# Altium schematic sheet CMOD_A7.SchDoc: CMOD-A7
size 420 x 297 mm; Author: P. Zdunek; CompanyName: WUT ISE; DrawnBy: P. Zdunek; Organization: WUT ISE; Address1: PW ISE; Address2: Nowowiejska 15/19 00-665 Warsaw; Address3: p.zdunek90@gmail.com; DocumentNumber: 3; Revision: 2; SheetNumber: 3; SheetTotal: 10; ModifiedBy: -; CheckedDate: -; DivGrp: WUT ISE; Designer: P. Zdunek; ModifiedDate: -; ProjectName: Sensor Box
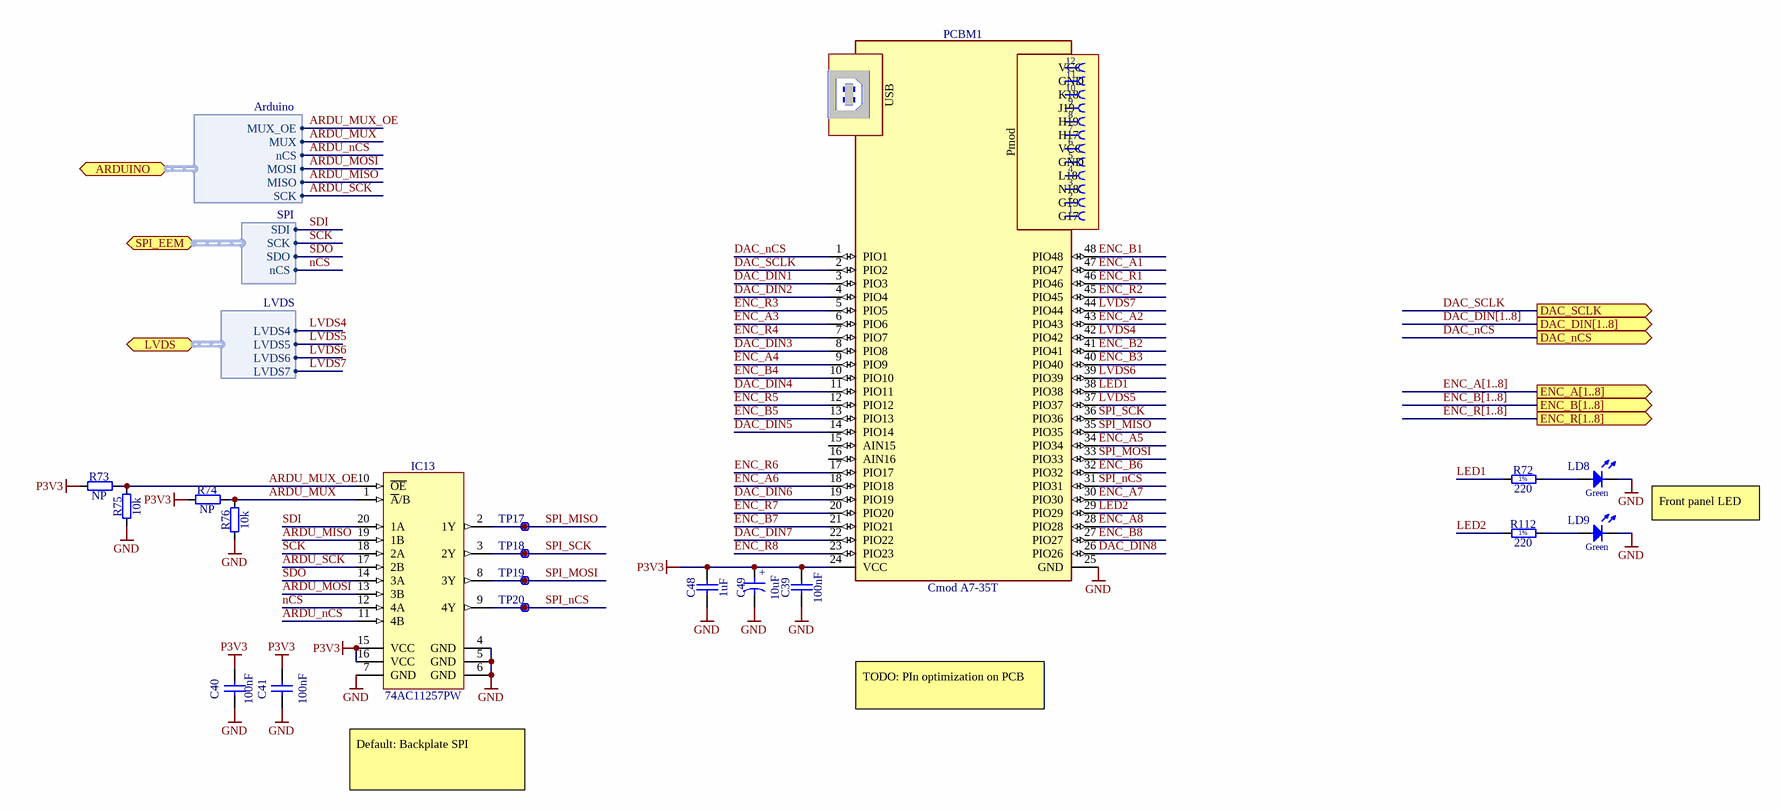
[diagram p0: CMOD_A7.SchDoc]

## Parts
C39  100nF  [CAPC1005X55N]
C40  100nF  [CAPC1005X55N]
C41  100nF  [CAPC1005X55N]
C48  1uF  [CAPC1608X87N]
C49  10uF  [CAPMP3216X180N]
IC13  74AC11257PW  [SOP65P640X120-20N]
LD8  Green  [LED_DIALIGHT_555-230]
LD9  Green  [LED_DIALIGHT_555-230]
PCBM1  Cmod A7-35T  [PCBM_DIGILENT_CMODA7]
R72  220  [RESC1608X55N]
R73  NP  [RESC1005X40N]
R74  NP  [RESC1005X40N]
R75  10k  [RESC1005X40N]
R76  10k  [RESC1005X40N]
R112  220  [RESC1608X55N]
TP17  Plated Hole  [c130h60]  (value not drawn)  (no BOM)
TP18  Plated Hole  [c130h60]  (value not drawn)  (no BOM)
TP19  Plated Hole  [c130h60]  (value not drawn)  (no BOM)
TP20  Plated Hole  [c130h60]  (value not drawn)  (no BOM)

## Ports
ARDUINO (bidir, harness Arduino), DAC_DIN[1..8] (out), DAC_nCS (out), DAC_SCLK (out), ENC_A[1..8] (out), ENC_B[1..8] (out), ENC_R[1..8] (out), LVDS (bidir, harness LVDS), SPI_EEM (bidir, harness SPI)

## Harnesses
Arduino: nCS, MOSI, MISO, SCK, MUX_OE, MUX
SPI: SDI, SCK, SDO, nCS
LVDS: LVDS4, LVDS5, LVDS6, LVDS7

## Nets
GND: C39.1 C40.1 C41.1 C48.1 C49.2 IC13.4(GND) IC13.5(GND) IC13.6(GND) IC13.7(GND) LD8.1(C) LD9.1(C) PCBM1.25(GND) R75.1 R76.1
P3V3: C39.2 C40.2 C41.2 C48.2 C49.1 IC13.15(VCC) IC13.16(VCC) PCBM1.24(VCC) R73.1 R74.1
ARDU_MISO: IC13.19(1B) ; port ARDUINO.MISO
ARDU_MOSI: IC13.13(3B) ; port ARDUINO.MOSI
ARDU_MUX: IC13.1(~{A}/B) R74.2 R76.2 ; port ARDUINO.MUX
ARDU_MUX_OE: IC13.10(~{OE}) R73.2 R75.2 ; port ARDUINO.MUX_OE
ARDU_nCS: IC13.11(4B) ; port ARDUINO.nCS
ARDU_SCK: IC13.17(2B) ; port ARDUINO.SCK
DAC_DIN1: PCBM1.3(PIO3)
DAC_DIN2: PCBM1.4(PIO4)
DAC_DIN3: PCBM1.8(PIO8)
DAC_DIN4: PCBM1.11(PIO11)
DAC_DIN5: PCBM1.14(PIO14)
DAC_DIN6: PCBM1.19(PIO19)
DAC_DIN7: PCBM1.22(PIO22)
DAC_DIN8: PCBM1.26(PIO26)
DAC_nCS: PCBM1.1(PIO1) ; port DAC_nCS
DAC_SCLK: PCBM1.2(PIO2) ; port DAC_SCLK
ENC_A1: PCBM1.47(PIO47)
ENC_A2: PCBM1.43(PIO43)
ENC_A3: PCBM1.6(PIO6)
ENC_A4: PCBM1.9(PIO9)
ENC_A5: PCBM1.34(PIO34)
ENC_A6: PCBM1.18(PIO18)
ENC_A7: PCBM1.30(PIO30)
ENC_A8: PCBM1.28(PIO28)
ENC_B1: PCBM1.48(PIO48)
ENC_B2: PCBM1.41(PIO41)
ENC_B3: PCBM1.40(PIO40)
ENC_B4: PCBM1.10(PIO10)
ENC_B5: PCBM1.13(PIO13)
ENC_B6: PCBM1.32(PIO32)
ENC_B7: PCBM1.21(PIO21)
ENC_B8: PCBM1.27(PIO27)
ENC_R1: PCBM1.46(PIO46)
ENC_R2: PCBM1.45(PIO45)
ENC_R3: PCBM1.5(PIO5)
ENC_R4: PCBM1.7(PIO7)
ENC_R5: PCBM1.12(PIO12)
ENC_R6: PCBM1.17(PIO17)
ENC_R7: PCBM1.20(PIO20)
ENC_R8: PCBM1.23(PIO23)
LED1: PCBM1.38(PIO38) R72.1
LED2: PCBM1.29(PIO29) R112.1
LVDS4: PCBM1.42(PIO42) ; port LVDS.LVDS4
LVDS5: PCBM1.37(PIO37) ; port LVDS.LVDS5
LVDS6: PCBM1.39(PIO39) ; port LVDS.LVDS6
LVDS7: PCBM1.44(PIO44) ; port LVDS.LVDS7
nCS: IC13.12(4A) ; port SPI_EEM.nCS
SCK: IC13.18(2A) ; port SPI_EEM.SCK
SDI: IC13.20(1A) ; port SPI_EEM.SDI
SDO: IC13.14(3A) ; port SPI_EEM.SDO
SPI_MISO: IC13.2(1Y) PCBM1.35(PIO35) TP17.1
SPI_MOSI: IC13.8(3Y) PCBM1.33(PIO33) TP19.1
SPI_nCS: IC13.9(4Y) PCBM1.31(PIO31) TP20.1
SPI_SCK: IC13.3(2Y) PCBM1.36(PIO36) TP18.1
NetLD8_2: LD8.2(A) R72.2
NetLD9_2: LD9.2(A) R112.2

Not connected (* = marked no-connect by the designer): PCBM1 15(AIN15) 16(AIN16)

## Buses and harness runs
bus DAC_DIN[1..8] = port DAC_DIN[1..8]
bus ENC_A[1..8] = port ENC_A[1..8]
bus ENC_B[1..8] = port ENC_B[1..8]
bus ENC_R[1..8] = port ENC_R[1..8]

## Notes on the sheet
- Front panel LED
- TODO: PIn optimization on PCB
- Default: Backplate SPI
- Project/Equipment
- Document
- Designer
- Drawn by
- Check.by
- Copyright WUT ISE 2020.
  This documentation describes Open Hardware and is licensed under the CERN OHL v.1.2. You may redistribute and modify this documentation under the terms of the CERN OHL v.1.2. (http://ohwr.org/CERNOHL). This documentation is distributed WITHOUT ANY EXPRESS OR IMPLIED WARRANTY, INCLUDING OF MERCHANTABILITY, SATISFACTORY QUALITY AND FITNESS FOR A PARTICULAR PURPOSE. Please see the CERN OHL v.1.2 for applicable conditions.
- Contact
- File
- Last Mod.
- Print Date
- Sheet
- Size
- A3
- of
- Rev
- (in symbol CTE3216-18_10UF_16V_20%_AVX_TCJ) +
- (in symbol PCBM_DIGILENT_CMOD A7-35T) USB; K18; J19; H19; H17; Pmod; L18; N18; G19; G17
- (in symbol R0603_220R_1%_0.1W_100PPM) 1%

## Library data of the parts
C39-C41 = CC0402_100NF_16V_10%_X5R: Non-polarised capacitor; Part Description: SMD Multilayer Chip Ceramic Capacitor; Manufacturer: GENERIC; Manufacturer1 Part Number: GRM155R61C104KA88D; Voltage: 16V; TC: X5R; Tolerance: ±10%; Part Number: CC0402_100NF_16V_10%_X5R; Component Kind: Standard; Component Type: Standard; Pin Count: 2; Value: 100nF; Status: None; Manufacturer Part Number: CC0402_100NF_16V_10%_X5R; Case: 0402; Mounted: Yes; Socket: No; SMD: Yes; Sense: No; Manufacturer1 Example: MURATA; Manufacturer1 ComponentHeight: 0.55mm; HelpURL: \\cern.ch\dfs\Applications\Altium\Datasheets\CC0402_X5R_MURATA_GRM.pdf; Author: CERN DEM JLC
  C39: CreateDate: 10.12.2013; LatestRevisionDate: 10.12.2013
  C40 C41: CreateDate: 10/12/2013; LatestRevisionDate: 10/12/2013
C48 = CC0603_1UF_25V_10%_X7R: Non-polarised capacitor; Part Description: SMD Multilayer Chip Ceramic Capacitor; Manufacturer: GENERIC; Manufacturer1 Part Number: GRM188R71E105KA12D; Voltage: 25V; TC: X7R; Tolerance: ±10%; Part Number: CC0603_1UF_25V_10%_X7R; Component Kind: Standard; Component Type: Standard; Pin Count: 2; Value: 1uF; Status: None; Manufacturer Part Number: CC0603_1UF_25V_10%_X7R; Case: 0603; Mounted: Yes; Socket: No; SMD: Yes; Sense: No; Manufacturer1 Example: MURATA; Manufacturer1 ComponentHeight: 0.9mm; HelpURL: \\cern.ch\dfs\Applications\Altium\Datasheets\CC0603_X7R_MURATA.pdf; Author: CERN DEM JLC; CreateDate: 18.01.2011; LatestRevisionDate: 18.01.2011
C49 = CTE3216-18_10UF_16V_20%_AVX_TCJ: Polarised capacitor; Part Description: ESR 0R200 Tantalum Solid Electrolytic Chip Capacitor with Conductive Polymer Electrode; Manufacturer: AVX; Manufacturer Part Number: TCJA106M016R0200 or  or TR3A106K016C1700; Voltage: 16V; Tolerance: ±20%; Part Number: CTE3216-18_10UF_16V_20%_AVX_TCJ; Component Kind: Standard; Component Type: Standard; Pin Count: 2; Value: 10uF; Status: Preferred; Case: A; Mounted: Yes; Socket: No; SMD: Yes; Sense: No; ComponentHeight: 1.8mm; HelpURL: \\cern.ch\dfs\Applications\Altium\Datasheets\CTE_AVX_TCJ.pdf; Author: CERN DEM JLC; CreateDate: 29.03.2012; LatestRevisionDate: 29.03.2012
IC13 = 74AC11257PW: Quadruple 2-Line to 1-Line Data Selector/Multiplexer With 3-State Outputs; Manufacturer: TEXAS INSTRUMENTS; PressFit: No; Bonding: No; Part Number: 74AC11257PW; Component Kind: Standard; Component Type: Standard; Device: 74AC11257PW; PackageDescription: SOP, 20-Leads, Body 6.5x4.4mm, Pitch 0.65mm, IPC Medium Density; Part Description: Quadruple 2-Line to 1-Line Data Selector/Multiplexer with 3-State Outputs; Manufacturer Part Number: 74AC11257PW; Pin Count: 20; Case: TSSOP20; Mounted: Yes; Socket: No; SMD: Yes; Sense: No; ComponentHeight: 1.2mm; Author: CERN DEM JLC; HelpURL: \\cern.ch\dfs\Applications\Altium\Datasheets\74AC11257PW.pdf; CreateDate: 26/03/2012; LatestRevisionDate: 26/03/2012
LD8 LD9 = LED_DIALIGHT_555-2301F: LED Green 1C 2A; Part Description: Single 2mm Green LED CBI® Circuit Board Indicator; PressFit: No; Bonding: No; Part Number: LED_DIALIGHT_555-2301F; Component Kind: Standard; Component Type: Standard; Color: Green; PackageDescription: Single 2mm Green LED, Body 5.08x2.54mm, Pin spacing 2.54mm; Manufacturer: DIALIGHT; Manufacturer Part Number: 555-2301F; Pin Count: 2; Mounted: Yes; Socket: No; SMD: No; Sense: No; ComponentHeight: 6.35mm; HelpURL: \\cern.ch\dfs\Applications\Altium\Datasheets\LED_DIALIGHT_555-2301F.pdf; Author: CERN DEM JMW; CreateDate: 22.09.2008; LatestRevisionDate: 17.03.2010
PCBM1 = PCBM_DIGILENT_CMOD A7-35T: Breadboardable Artix-7 FPGA Module; PressFit: No; Bonding: No; Part Number: PCBM_DIGILENT_CMOD A7-35T; Component Kind: Standard; Component Type: Standard; Device: Cmod A7-35T; PackageDescription: Breadboardable Artix-7 FPGA Module; Part Description: Breadboardable Artix-7 FPGA Module; Manufacturer: DIGILENT; Manufacturer Part Number: Cmod A7-35T; Pin Count: 48; Mounted: Yes; Socket: No; SMD: No; Sense: No; ComponentHeight: 12.55mm; Author: CERN DEM BC; HelpURL: \\cern.ch\dfs\Applications\Altium\Datasheets\PCBM_DIGILENT_CMODA7.pdf; CreateDate: 07/02/2019; LatestRevisionDate: 06/02/2023
R72 R112 = R0603_220R_1%_0.1W_100PPM: Resistor - 1%; Part Description: General Purpose Thick Film Chip Resistor; Manufacturer: GENERIC; Manufacturer1 Part Number: NRC06F2200TRF; Power: 0.1W; TC: ±100ppm/°C; Part Number: R0603_220R_1%_0.1W_100PPM; Component Kind: Standard; Component Type: Standard; Pin Count: 2; Value: 220; Status: Preferred; Tolerance: ±1%; Manufacturer Part Number: R0603_220R_1%_0.1W_100PPM; Case: 0603; Mounted: Yes; Sense: No; Socket: No; SMD: Yes; Manufacturer1 Example: NIC COMPONENT; Manufacturer1 ComponentHeight: 0.55mm; HelpURL: \\cern.ch\dfs\Applications\Altium\Datasheets\R0603_NIC_NRC.pdf; Author: CERN DEM JLC; CreateDate: 03.12.2007; LatestRevisionDate: 13.03.2008
R73 R74 = R0402_10K_1%_0.0625W_100PPM: Resistor - 1%; Part Description: General Purpose Thick Film Chip Resistor; Manufacturer: GENERIC; Manufacturer1 Part Number: 232270671003L; Value: 10k; TC: ±100ppm/°C; PressFit: No; Part Number: R0402_10K_1%_0.0625W_100PPM; Component Kind: Standard; Component Type: Standard; Pin Count: 2; Status: Not Recommended; Power: 0.0625W; Tolerance: ±1%; Manufacturer Part Number: R0402_10K_1%_0.0625W_100PPM; Case: 0402; Mounted: Yes; Sense: No; Socket: No; SMD: Yes; Manufacturer1 Example: YAGEO PHYCOMP; Manufacturer1 ComponentHeight: 0.4mm; HelpURL: \\cern.ch\dfs\Applications\Altium\Datasheets\R0402_Phycomp_RC0402.pdf; Author: CERN DEM JLC; CreateDate: 03/12/2007; LatestRevisionDate: 17/10/2012
R75 R76 = R0402_10K_1%_0.0625W_100PPM: Resistor - 1%; Part Description: General Purpose Thick Film Chip Resistor; Manufacturer: GENERIC; Manufacturer1 Part Number: 232270671003L; TC: ±100ppm/°C; PressFit: No; Part Number: R0402_10K_1%_0.0625W_100PPM; Component Kind: Standard; Component Type: Standard; Pin Count: 2; Value: 10k; Status: Not Recommended; Power: 0.0625W; Tolerance: ±1%; Manufacturer Part Number: R0402_10K_1%_0.0625W_100PPM; Case: 0402; Mounted: Yes; Sense: No; Socket: No; SMD: Yes; Manufacturer1 Example: YAGEO PHYCOMP; Manufacturer1 ComponentHeight: 0.4mm; HelpURL: \\cern.ch\dfs\Applications\Altium\Datasheets\R0402_Phycomp_RC0402.pdf; Author: CERN DEM JLC; CreateDate: 03/12/2007; LatestRevisionDate: 17/10/2012
TP17-TP20 = PLATED_HOLE0.6_PAD1.3: Single Terminal Socket; Part Description: Plated Through Hole: Hole Dia.=0.6mm Pad Dia.=1.3mm; Mounted: No; Part Number: PLATED_HOLE0.6_PAD1.3; Component Type: Standard (No BOM); Pin Count: 1; Family: Plated Hole; Socket: No; SMD: No; Sense: No; Status: None; ComponentHeight: 0mm; HelpURL: Undefined; Author: CERN DEM MR; CreateDate: 02/03/2016; LatestRevisionDate: 02/03/2016; PackageDescription: Plated Through Hole: Hole Dia.=0.6mm Pad Dia.=1.3mm